# Altium schematic sheet power.SchDoc
size 420 x 297 mm; Author: ALTIUM GOSTBOM2.0 KEV; SheetNumber: 1; SheetTotal: 2
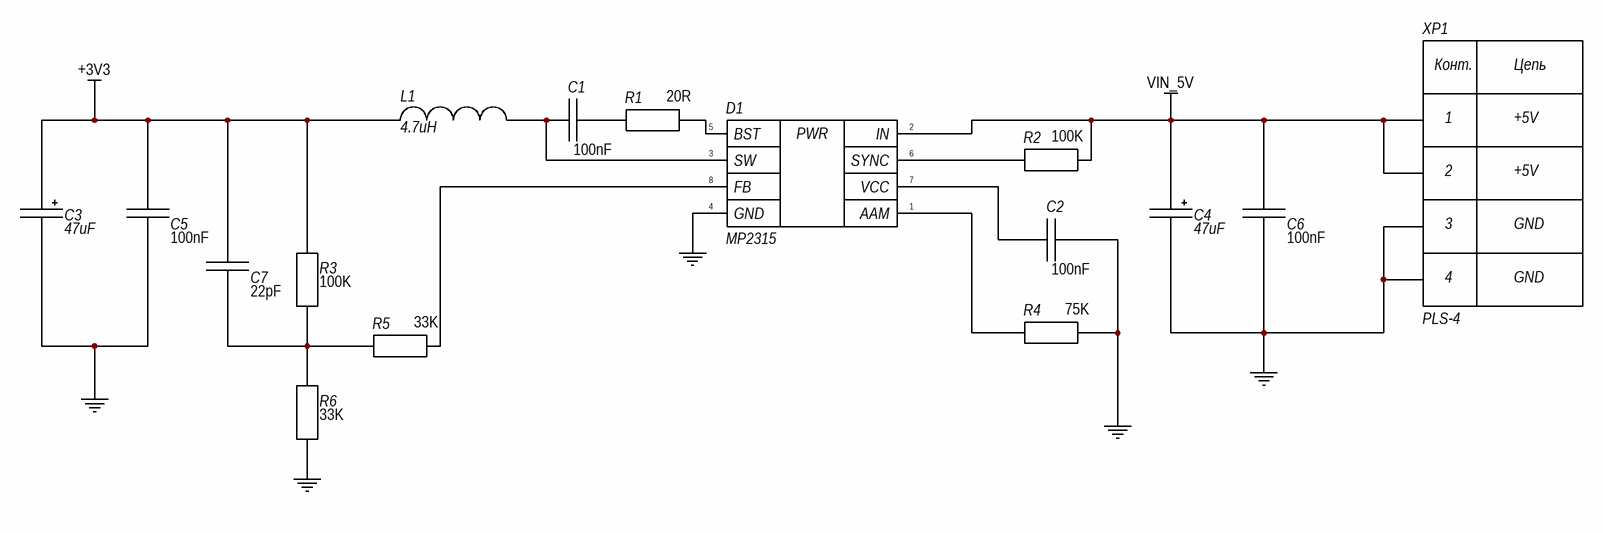
[diagram p0: power.SchDoc]

## Parts
C1  100nF  [SMD 0805]
C2  100nF  [SMD 0805]
C3  47uF  [SMD47 ECAP]
C4  47uF  [SMD47 ECAP]
C5  100nF  [SMD 0805]
C6  100nF  [SMD 0805]
C7  22pF  [SMD 0805]
D1  MP2315  [PWR_MP2315]
L1  4.7uH  [SP43-4R7M]
R1  20R  [RESC0805]
R2  100K  [RESC0805]
R3  100K  [RESC0805]
R4  75K  [RESC0805]
R5  33K  [RESC0805]
R6  33K  [RESC0805]
XP1  PLS-4  [PLS-4]

## Nets
+3V3: C3.1 C5.2 C7.2 L1.1 R3.2
GND: C2.1 C3.2 C4.2 C5.1 C6.2 D1.4(GND) R4.2 R6.1 XP1.3 XP1.4
VIN_5V: C4.1 C6.1 D1.2(IN) R2.2 XP1.1 XP1.2
NetC1_1: C1.1 R1.1
NetC1_2: C1.2 D1.3(SW) L1.2
NetC2_2: C2.2 D1.7(VCC)
NetC7_1: C7.1 R3.1 R5.1 R6.2
NetD1_1: D1.1(AAM) R4.1
NetD1_5: D1.5(BST) R1.2
NetD1_6: D1.6(SYNC) R2.1
NetD1_8: D1.8(FB) R5.2

## Notes on the sheet
- Перв. примен.
- Справ. №
- Подп. дата
- Инв. № дубл.
- Взам. инв. №
- Подп. и дата
- Изм.
- Разраб.
- Лист
- № докум.
- Подп.
- Дата
- Лит.
- Масса
- Масштаб
- Пров.
- Т.контр.
- Листов
- Инв. № подл.
- Н.контр.
- Утв.
- ALTIUM GOSTBOM2.0 KEV
- Файл:
- Копировал
- Формат А3
- (in symbol MP2315) PWR
- (in symbol SMT_POWER) Конт.; Цепь; +5V; GND

## Library data of the parts
C1 C2 C5 C6 = 100nF: Конденсатор номиналом 1.5 nF
C3 C4 = 47uF: Электролитический конденсатор номиналом 47uF
C7 = 22pF: Конденсатор номиналом 22 pF
D1 = MP2315: Микросхема понижающего преобразователя напряжения со встроенным синхронным выпрямителем на МОП-транзисторах.
L1 = 4.7u: Катушка индуктивности 4.7 мкГн
R1 = 20R: Резистор номиналом 20 Ом
R2 R3 = 100K: Резистор номиналом 100 кОм
R4 = 75K: Резистор номиналом 75 кОм
R5 R6 = 33K: Резистор номиналом 33 кОм
XP1 = SMT_POWER: SMT-разъём для связи платы ПП с периферийными устройствами